# EAGLE design sampler (EAGLE 9.6.2)

## Sheet 1 of 2
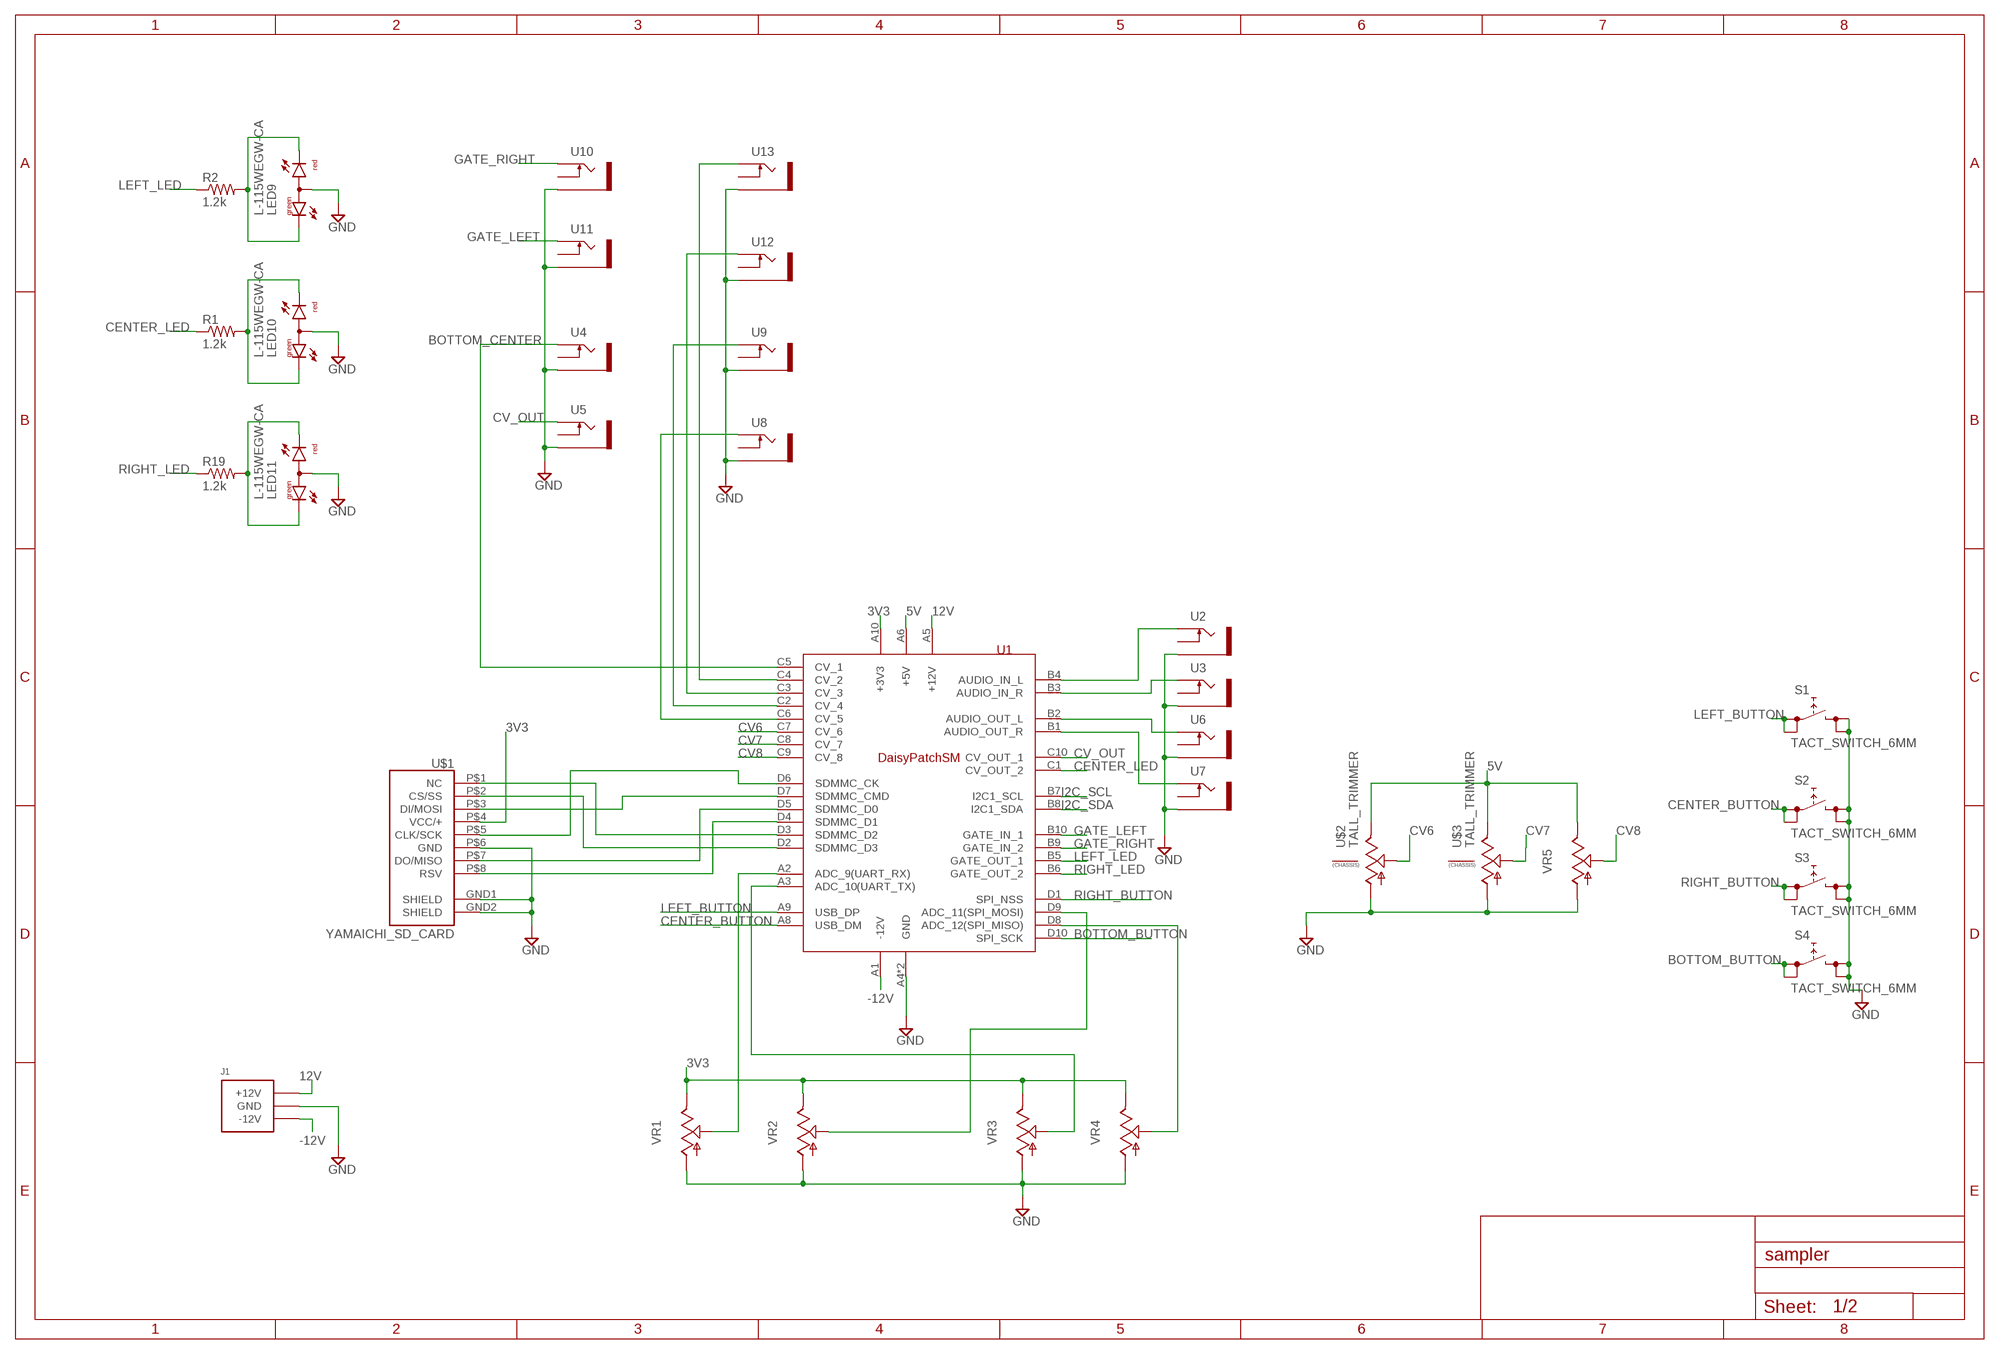
[diagram p0: schematic, sheet 1]

### Parts
J1  POWER_SIMPLE10  [POWER_10]
LED9  L-115WEGW-CA  [DUOLED-A-3MM]
LED10  L-115WEGW-CA  [DUOLED-A-3MM]
LED11  L-115WEGW-CA  [DUOLED-A-3MM]
R1  1.2k  R-US_R0603  [R0603]
R2  1.2k  R-US_R0603  [R0603]
R19  1.2k  R-US_R0603  [R0603]
S1  TACT_SWITCH_6MM  [TACT_SWITCH_6MM]
S2  TACT_SWITCH_6MM  [TACT_SWITCH_6MM]
S3  TACT_SWITCH_6MM  [TACT_SWITCH_6MM]
S4  TACT_SWITCH_6MM  [TACT_SWITCH_6MM]
U1  ES_DAISY_PATCH_SM  [ES_DAISY_PATCH_SM_REV1]
U2  THONKICONNNEW  [WQP-PJ301M-12_JACK]
U3  THONKICONNNEW  [WQP-PJ301M-12_JACK]
U4  THONKICONNNEW  [WQP-PJ301M-12_JACK]
U5  THONKICONNNEW  [WQP-PJ301M-12_JACK]
U6  THONKICONNNEW  [WQP-PJ301M-12_JACK]
U7  THONKICONNNEW  [WQP-PJ301M-12_JACK]
U8  THONKICONNNEW  [WQP-PJ301M-12_JACK]
U9  THONKICONNNEW  [WQP-PJ301M-12_JACK]
U10  THONKICONNNEW  [WQP-PJ301M-12_JACK]
U11  THONKICONNNEW  [WQP-PJ301M-12_JACK]
U12  THONKICONNNEW  [WQP-PJ301M-12_JACK]
U13  THONKICONNNEW  [WQP-PJ301M-12_JACK]
U$1  YAMAICHI_SD_CARD  [YAMAICHI_MICROSD_VERTICAL]
U$2  TALL_TRIMMER  [TALL_TRIMMER]
U$3  TALL_TRIMMER  [TALL_TRIMMER]
VR1  9MM_SNAP-IN_POT_  [9MM_SNAP-IN_POT]
VR2  9MM_SNAP-IN_POT_  [9MM_SNAP-IN_POT]
VR3  9MM_SNAP-IN_POT_  [9MM_SNAP-IN_POT]
VR4  9MM_SNAP-IN_POT_  [9MM_SNAP-IN_POT]
VR5  9MM_SNAP-IN_POT_  [9MM_SNAP-IN_POT]

### Nets
3V3: U1.A10(+3V3) U$1.P$4(VCC/+) VR1.3(E) VR2.3(E) VR3.3(E) VR4.3(E) ; also sheet 2
5V: U1.A6(+5V) U$2.3(E) U$3.3(E) VR5.3(E)
12V: J1.9(+12V) J1.10(+12V) U1.A5(+12V)
-12V: J1.1(-12V) J1.2(-12V) U1.A1(-12V)
BOTTOM_BUTTON: S4.P$1 S4.P$2 U1.D10(SPI_SCK)
BOTTOM_CENTER: U1.C5(CV_1) U4.P$1_TIP(TIP)
CENTER_BUTTON: S2.P$1 S2.P$2 U1.A8(USB_DM)
CENTER_LED: R1.1 U1.C1(CV_OUT_2)
CV6: U1.C7(CV_6) U$2.2(S)
CV7: U1.C8(CV_7) U$3.2(S)
CV8: U1.C9(CV_8) VR5.2(S)
CV_OUT: U1.C10(CV_OUT_1) U5.P$1_TIP(TIP)
GATE_LEFT: U1.B10(GATE_IN_1) U11.P$1_TIP(TIP)
GATE_RIGHT: U1.B9(GATE_IN_2) U10.P$1_TIP(TIP)
GND: J1.3(GND) J1.4(GND) J1.5(GND) J1.6(GND) J1.7(GND) J1.8(GND) LED9.2(A) LED10.2(A) LED11.2(A) S1.P$3 S1.P$4 S2.P$3 S2.P$4 S3.P$3 S3.P$4 S4.P$3 S4.P$4 U1.A4(GND) U1.A7(GND) U2.P$3_SLEEVE(SLEEVE) U3.P$3_SLEEVE(SLEEVE) U4.P$3_SLEEVE(SLEEVE) U5.P$3_SLEEVE(SLEEVE) U6.P$3_SLEEVE(SLEEVE) U7.P$3_SLEEVE(SLEEVE) U8.P$3_SLEEVE(SLEEVE) U9.P$3_SLEEVE(SLEEVE) U10.P$3_SLEEVE(SLEEVE) U11.P$3_SLEEVE(SLEEVE) U12.P$3_SLEEVE(SLEEVE) U13.P$3_SLEEVE(SLEEVE) U$1.GND1(SHIELD) U$1.GND2(SHIELD) U$1.P$6(GND) U$2.1(A) U$3.1(A) VR1.1(A) VR2.1(A) VR3.1(A) VR4.1(A) VR5.1(A) ; also sheet 2
I2C_SCL: U1.B7(I2C1_SCL) ; also sheet 2
I2C_SDA: U1.B8(I2C1_SDA) ; also sheet 2
LEFT_BUTTON: S1.P$1 S1.P$2 U1.A9(USB_DP)
LEFT_LED: R2.1 U1.B5(GATE_OUT_1)
N$1: U1.D3(SDMMC_D2) U$1.P$1(NC)
N$2: LED9.1(CG) LED9.3(CR) R2.2
N$4: U1.D4(SDMMC_D1) U$1.P$8(RSV)
N$5: U1.D5(SDMMC_D0) U$1.P$7(DO/MISO)
N$6: U1.D2(SDMMC_D3) U$1.P$2(CS/SS)
N$7: U1.D6(SDMMC_CK) U$1.P$5(CLK/SCK)
N$8: U1.D7(SDMMC_CMD) U$1.P$3(DI/MOSI)
N$9: U1.B2(AUDIO_OUT_L) U6.P$1_TIP(TIP)
N$10: U1.B4(AUDIO_IN_L) U2.P$1_TIP(TIP)
N$11: U1.B3(AUDIO_IN_R) U3.P$1_TIP(TIP)
N$12: U1.B1(AUDIO_OUT_R) U7.P$1_TIP(TIP)
N$13: U1.A3(ADC_10(UART_TX)) VR3.2(S)
N$14: U1.A2(ADC_9(UART_RX)) VR1.2(S)
N$15: U1.D9(ADC_11(SPI_MOSI)) VR2.2(S)
N$16: U1.D8(ADC_12(SPI_MISO)) VR4.2(S)
N$17: LED10.1(CG) LED10.3(CR) R1.2
N$18: U1.C4(CV_2) U13.P$1_TIP(TIP)
N$19: U1.C3(CV_3) U12.P$1_TIP(TIP)
N$20: LED11.1(CG) LED11.3(CR) R19.2
N$21: U1.C2(CV_4) U9.P$1_TIP(TIP)
N$22: U1.C6(CV_5) U8.P$1_TIP(TIP)
RIGHT_BUTTON: S3.P$1 S3.P$2 U1.D1(SPI_NSS)
RIGHT_LED: R19.1 U1.B6(GATE_OUT_2)
Unconnected: U2.P$2_SWITCH(SWITCH) U3.P$2_SWITCH(SWITCH) U4.P$2_SWITCH(SWITCH) U5.P$2_SWITCH(SWITCH) U6.P$2_SWITCH(SWITCH) U7.P$2_SWITCH(SWITCH) U8.P$2_SWITCH(SWITCH) U9.P$2_SWITCH(SWITCH) U10.P$2_SWITCH(SWITCH) U11.P$2_SWITCH(SWITCH) U12.P$2_SWITCH(SWITCH) U13.P$2_SWITCH(SWITCH) U$2.CHASSIS1 U$2.CHASSIS2 U$3.CHASSIS1 U$3.CHASSIS2

## Sheet 2 of 2
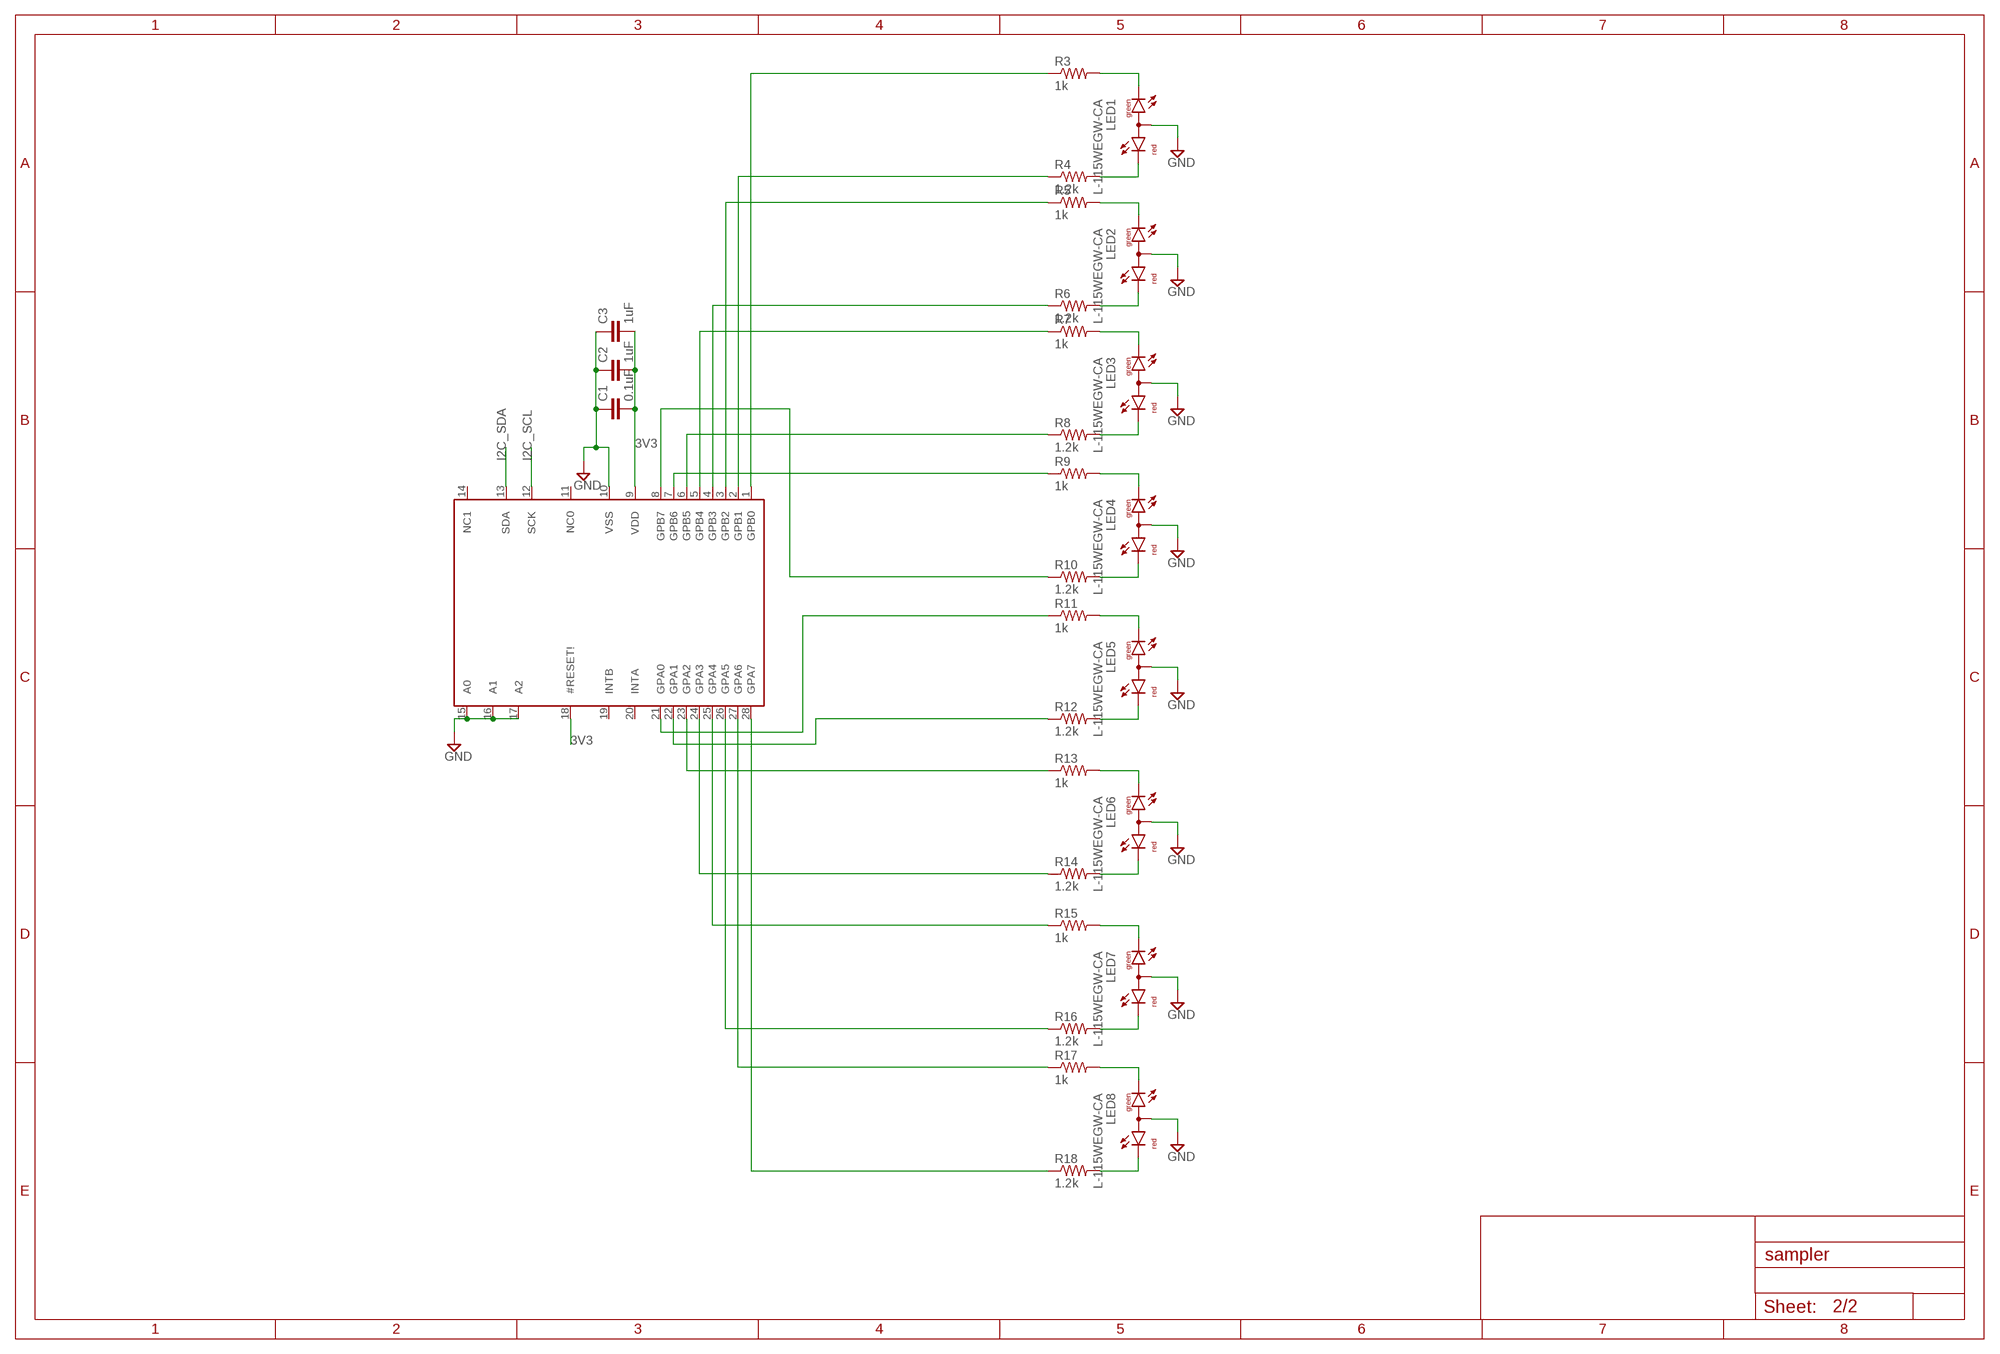
[diagram p1: schematic, sheet 2]

### Parts
C1  0.1uF  C-EUC0805  [C0805]
C2  1uF  C-EUC0805  [C0805]
C3  1uF  C-EUC0805  [C0805]
LED1  L-115WEGW-CA  [DUOLED-A-3MM]
LED2  L-115WEGW-CA  [DUOLED-A-3MM]
LED3  L-115WEGW-CA  [DUOLED-A-3MM]
LED4  L-115WEGW-CA  [DUOLED-A-3MM]
LED5  L-115WEGW-CA  [DUOLED-A-3MM]
LED6  L-115WEGW-CA  [DUOLED-A-3MM]
LED7  L-115WEGW-CA  [DUOLED-A-3MM]
LED8  L-115WEGW-CA  [DUOLED-A-3MM]
R3  1k  R-US_R0603  [R0603]
R4  1.2k  R-US_R0603  [R0603]
R5  1k  R-US_R0603  [R0603]
R6  1.2k  R-US_R0603  [R0603]
R7  1k  R-US_R0603  [R0603]
R8  1.2k  R-US_R0603  [R0603]
R9  1k  R-US_R0603  [R0603]
R10  1.2k  R-US_R0603  [R0603]
R11  1k  R-US_R0603  [R0603]
R12  1.2k  R-US_R0603  [R0603]
R13  1k  R-US_R0603  [R0603]
R14  1.2k  R-US_R0603  [R0603]
R15  1k  R-US_R0603  [R0603]
R16  1.2k  R-US_R0603  [R0603]
R17  1k  R-US_R0603  [R0603]
R18  1.2k  R-US_R0603  [R0603]
U$4  MCP23017  [SSOP28]

### Nets
3V3: C1.2 C2.2 C3.2 U$4.9(VDD) U$4.18(#RESET!) ; also sheet 1
GND: C1.1 C2.1 C3.1 LED1.2(A) LED2.2(A) LED3.2(A) LED4.2(A) LED5.2(A) LED6.2(A) LED7.2(A) LED8.2(A) U$4.10(VSS) U$4.15(A0) U$4.16(A1) U$4.17(A2) ; also sheet 1
I2C_SCL: U$4.12(SCK) ; also sheet 1
I2C_SDA: U$4.13(SDA) ; also sheet 1
N$3: R3.1 U$4.1(GPB0)
N$23: LED1.1(CG) R3.2
N$24: LED1.3(CR) R4.2
N$25: R4.1 U$4.2(GPB1)
N$26: R5.1 U$4.3(GPB2)
N$27: LED2.1(CG) R5.2
N$28: LED2.3(CR) R6.2
N$29: R6.1 U$4.4(GPB3)
N$30: R7.1 U$4.5(GPB4)
N$31: LED3.1(CG) R7.2
N$32: LED3.3(CR) R8.2
N$33: R8.1 U$4.6(GPB5)
N$34: R9.1 U$4.7(GPB6)
N$35: LED4.1(CG) R9.2
N$36: LED4.3(CR) R10.2
N$37: R10.1 U$4.8(GPB7)
N$38: R11.1 U$4.21(GPA0)
N$39: LED5.1(CG) R11.2
N$40: LED5.3(CR) R12.2
N$41: R12.1 U$4.22(GPA1)
N$42: R13.1 U$4.23(GPA2)
N$43: LED6.1(CG) R13.2
N$44: LED6.3(CR) R14.2
N$45: R14.1 U$4.24(GPA3)
N$46: R15.1 U$4.25(GPA4)
N$47: LED7.1(CG) R15.2
N$48: LED7.3(CR) R16.2
N$49: R16.1 U$4.26(GPA5)
N$50: R17.1 U$4.27(GPA6)
N$51: LED8.1(CG) R17.2
N$52: LED8.3(CR) R18.2
N$53: R18.1 U$4.28(GPA7)
Unconnected: U$4.11(NC0) U$4.14(NC1) U$4.19(INTB) U$4.20(INTA)

## Library data of the parts
C1-C3 = rcl:C-EU: CAPACITOR, European symbol; SPICEPREFIX: C
J1 = BitFox:POWER_SIMPLE
LED1-LED11 = led:L-115WEGW-CA: T-1(3mm) BI-COLOR INDICATOR LAMP Source: Kingbright .. 2_colour_led_.pdf
R1-R19 = rcl:R-US_: RESISTOR, American symbol; SPICEPREFIX: R
S1-S4 = BitFox:TACT_SWITCH_6MM
U1 = Electrosmith_Boards:ES_DAISY_PATCH_SM
U2-U13 = MusicThingModular:THONKICONN: 3.5mm socket for Eurorack modular synths
U$1 = MusicThingModular:YAMAICHI_SD_CARD: Vertical SD Card Holder
U$2 U$3 = BitFox:TALL_TRIMMER
U$4 = BitFox:MCP23017
VR1-VR5 = BitFox:9MM_SNAP-IN_POT: 9mm vertical snap-in pot, Alpha / Panasonic style

## Board
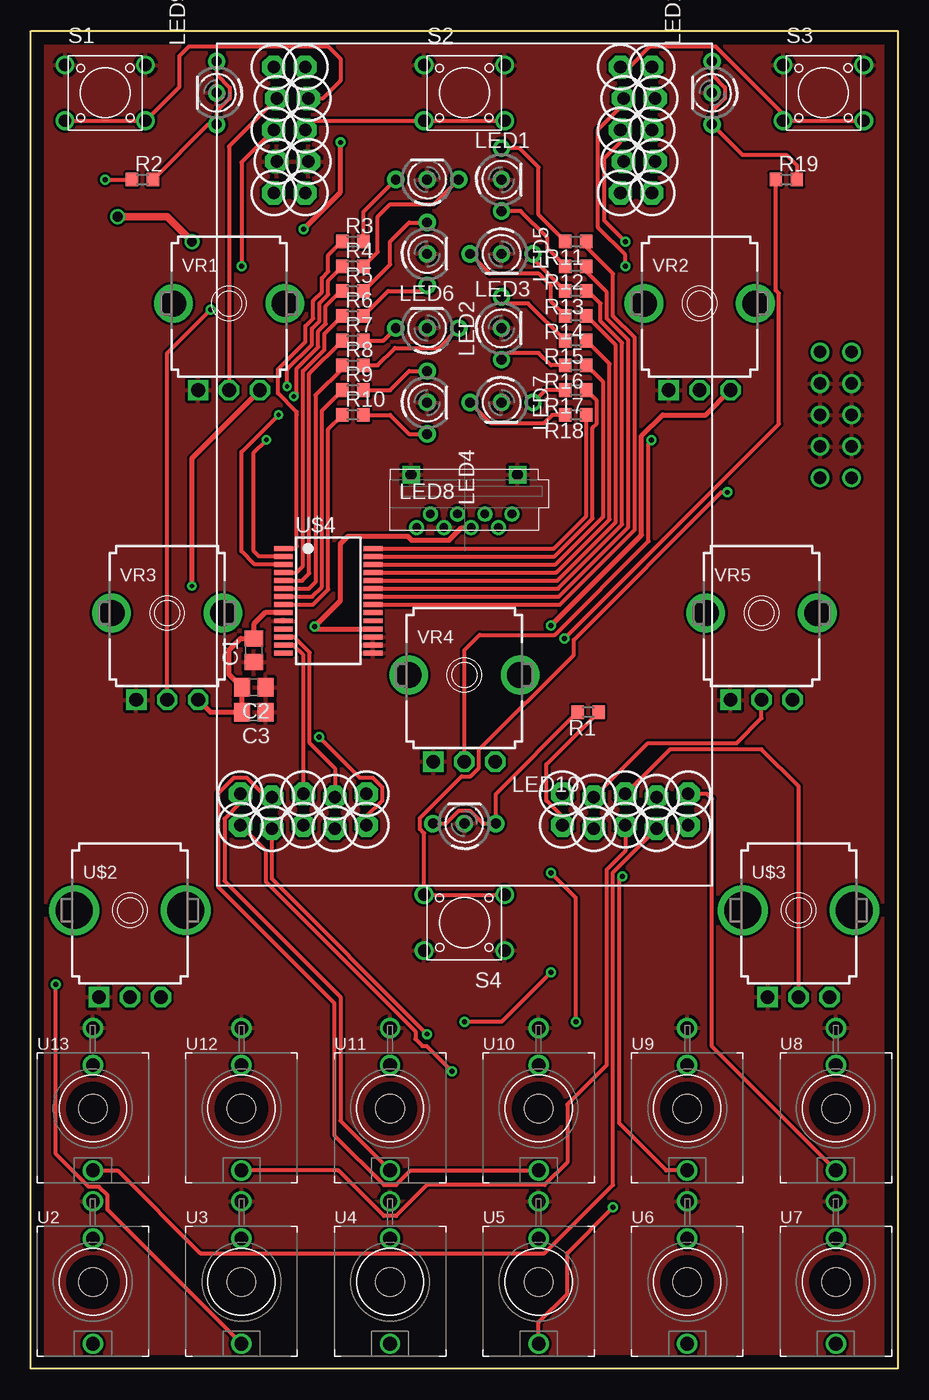
[diagram p2: board, top side]
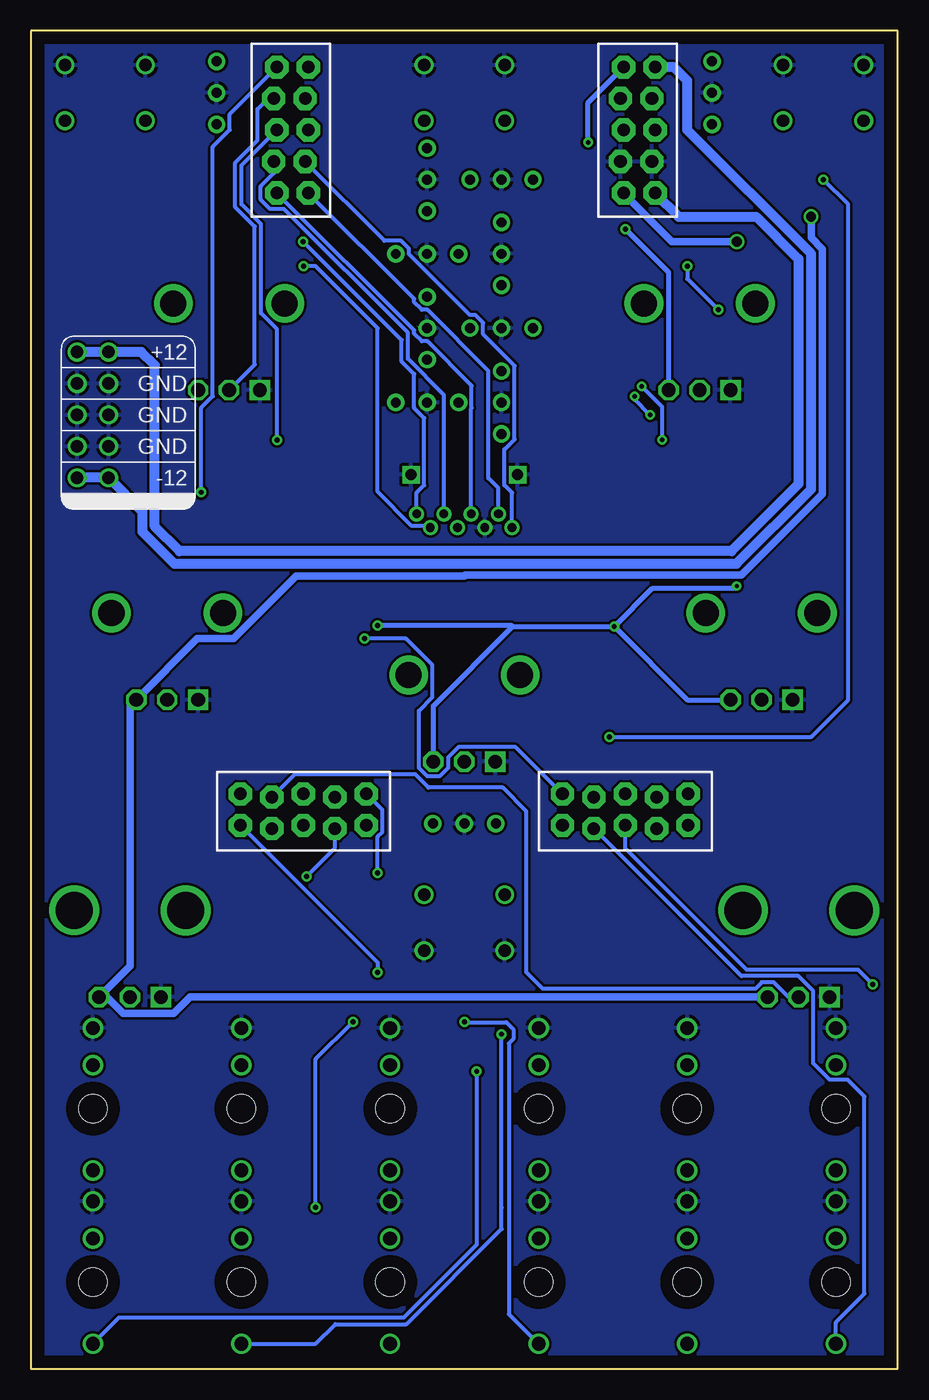
[diagram p3: board, bottom side, seen from below]

Size 70 x 108 mm. Coordinates in mm from the lower left corner, seen from the top.
Outline: 0,0 0,108 70,108 70,0 0,0
Copper layers (1*16): Top 0.035mm / dielectric 1.5mm / Bottom 0.035mm
Design rules "default *": minimum track width 8mil, minimum drill 0.35mm, track to track 8mil, track to pad 8mil, pad to pad 8mil, via to via 8mil, smd to smd 8mil, copper to edge 40mil, drill to drill 6mil, minimum pad ring 10mil, minimum via ring 8mil, stop-mask expansion 4mil, vias tented up to drill 0mil, thermal gap 10mil

### Footprints (pad centres in the part's own frame; a part is rotated, then mirrored left to right if it is on the bottom)
C0805 = smd 1.3 x 1.5: 1 -0.95,0; 2 0.95,0
POWER_10 = drill 1.016: 1 -5.08,-1.27; 2 -5.08,1.27; 3 -2.54,-1.27; 4 -2.54,1.27; 5 0,-1.27; 6 0,1.27; 7 2.54,-1.27; 8 2.54,1.27; 9 5.08,-1.27; 10 5.08,1.27
DUOLED-A-3MM = drill 0.8 pad 1.4: 1 -2.54,0; 2 0,0; 3 2.54,0
R0603 = smd 1 x 1.1: 1 -0.85,0; 2 0.85,0
TACT_SWITCH_6MM = drill 1: P$1 -3.25,-2.25; P$2 3.25,-2.25; P$3 -3.25,2.25; P$4 3.25,2.25
ES_DAISY_PATCH_SM_REV1 = drill 1.016 pad 1.88 octagon: A1 -32.08,-15.397; A2 -29.54,-15.143; A3 -27,-15.397; A4 -24.46,-15.143; A5 -21.92,-15.397; A6 -21.92,-12.857; A7 -24.46,-12.603; A8 -27,-12.857; A9 -29.54,-12.603; A10 -32.08,-12.857; B1 29.143,-18.08; B2 29.397,-15.54; B3 29.143,-13; B4 29.397,-10.46; B5 29.143,-7.92; B6 26.603,-7.92; B7 26.857,-10.46; B8 26.603,-13; B9 26.857,-15.54; B10 26.603,-18.08; C1 29.143,7.92; C2 29.397,10.46; C3 29.143,13; C4 29.397,15.54; C5 29.143,18.08; C6 26.603,18.08; C7 26.857,15.54; C8 26.603,13; C9 26.857,10.46; C10 26.603,7.92; D1 -32.08,12.603; D2 -29.54,12.857; D3 -27,12.603; D4 -24.46,12.857; D5 -21.92,12.603; D6 -21.92,15.143; D7 -24.46,15.397; D8 -27,15.143; D9 -29.54,15.397; D10 -32.08,15.143
WQP-PJ301M-12_JACK = drill 1.1: P$1_TIP 0,5; P$2_SWITCH 0,-3.5; P$3_SLEEVE 0,-6.5 | hole 2.286: 0,0
YAMAICHI_MICROSD_VERTICAL = drill 0.9 square: GND1 -4.3,-3.17; GND2 4.3,-3.17 | drill 0.7: P$1 -3.85,0; P$2 -2.75,1.1; P$3 -1.65,0; P$4 -0.55,1.1; P$5 0.55,0; P$6 1.65,1.1; P$7 2.75,0; P$8 3.85,1.1
TALL_TRIMMER = drill 1.1 square: 1 -2.5,-7 | drill 1.1 octagon: 2 0,-7; 3 2.5,-7 | drill 3.003 pad 3.48: CHASSIS1 -4.5,0 | drill 2.997 pad 3.48: CHASSIS2 4.5,0
SSOP28 = smd 0.4 x 1.5: 1 -4.225,-3.625; 2 -3.575,-3.625; 3 -2.925,-3.625; 4 -2.275,-3.625; 5 -1.625,-3.625; 6 -0.975,-3.625; 7 -0.325,-3.625; 8 0.325,-3.625; 9 0.975,-3.625; 10 1.625,-3.625; 11 2.275,-3.625; 12 2.925,-3.625; 13 3.575,-3.625; 14 4.225,-3.625; 15 4.225,3.625; 16 3.575,3.625; 17 2.925,3.625; 18 2.275,3.625; 19 1.625,3.625; 20 0.975,3.625; 21 0.325,3.625; 22 -0.325,3.625; 23 -0.975,3.625; 24 -1.625,3.625; 25 -2.275,3.625; 26 -2.925,3.625; 27 -3.575,3.625; 28 -4.225,3.625
9MM_SNAP-IN_POT = drill 1.1 square: 1 -2.5,-7 | drill 1.1 octagon: 2 0,-7; 3 2.5,-7 | drill 2.1 pad 2.794: CHASSIS1 -4.5,0; CHASSIS2 4.5,0

### Placement (x,y rotation side)
C1  18,58 90 top
C2  18,55 180 top
C3  18,53 180 top
J1  65,77 90 bottom
LED1  32,96 0 top
LED2  32,90 270 top
LED3  32,84 0 top
LED4  32,78 270 top
LED5  38,96 270 top
LED6  38,90 180 top
LED7  38,84 270 top
LED8  38,78 180 top
LED9  15,103 90 top
LED10  35,44 0 top
LED11  55,103 90 top
R1  45,53 180 top
R2  9,96 0 top
R3  26,91 0 top
R4  26,89 0 top
R5  26,87 0 top
R6  26,85 0 top
R7  26,83 0 top
R8  26,81 0 top
R9  26,79 0 top
R10  26,77 0 top
R11  44,91 180 top
R12  44,89 180 top
R13  44,87 180 top
R14  44,85 180 top
R15  44,83 180 top
R16  44,81 180 top
R17  44,79 180 top
R18  44,77 180 top
R19  61,96 0 top
S1  6,103 0 top
S2  35,103 0 top
S3  64,103 0 top
S4  35,36 180 top
U1  35,73 270 top
U2  5,7 180 top
U3  17,7 180 top
U4  29,7 180 top
U5  41,7 180 top
U6  53,7 180 top
U7  65,7 180 top
U8  65,21 180 top
U9  53,21 180 top
U10  41,21 180 top
U11  29,21 180 top
U12  17,21 180 top
U13  5,21 180 top
U$1  35,69 180 top
U$2  8,37 0 top
U$3  62,37 0 top
U$4  24,62 270 top
VR1  16,86 0 top
VR2  54,86 0 top
VR3  11,61 0 top
VR4  35,56 0 top
VR5  59,61 0 top

### Tracks (layer width: path | path; a pad name or v marks a point on that pad's centre or on a via)
3V3  (via drill 0.35, 0.4)
  Top 0.406: U$4.18 23.07,59.73 v22.9,59.9 25,62 25,66.6 25.6,67.2 30.42,67.2 30.73,66.89 33.77,66.89 34.78,67.9 U$1.P$4 | v42,60 49.31,67.31 49.31,75.31 51,77 54.5,77 VR2.3 | v22,92 25,95 v25,99 | v13,63.18 13,73.5 VR1.3 | U$4.9 18.93,61.02 18,60.1 C1.2 16.95,58.95 16,58 16,56.05 C2.2 C3.2 14.5,53 VR3.3
  Bottom 0.406: v22.9,59.9 17,54 VR3.3 | VR4.3 37.5,53.5 31.1,59.9 | 31.1,59.9 v22.9,59.9 | 31.1,59.9 31.2,60 v42,60 | VR1.3 18.5,88.5 v22,92 | v25,99 25,102.22 U1.A10 | v22.9,59.9 19.8,63 13.18,63 v13,63.18
5V  (via drill 0.8)
  Top 0.61: v7,93 11,93 v13,91
  Bottom 0.61: U$2.3 57.13,30 58.47,28.67 62.55,28.67 63.88,30 U$3.3 62,32.5 62,53.5 VR5.3 56.57,58.93 53.64,58.93 48.58,64 35,64 34.93,64.07 12.64,64.07 6.09,70.62 6.09,90.38 7,91.29 v7,93 | v13,91 18.22,91 U1.A6
12V
  Bottom 0.813: J1.10 J1.9 61.08,82.08 60,81 60,68 58,66 13.44,66 8.02,71.42 8.02,89.58 11.44,93 17.68,93 U1.A5
-12V
  Bottom 0.813: J1.2 J1.1 61.02,69.21 61.02,67.58 58.42,64.98 13.02,64.98 7,71 7,90 17,100 17,104 18.08,105.08 U1.A1
BOTTOM_BUTTON  (via drill 0.4)
  Top 0.305: S4.P$1 S4.P$2 31.75,43.22 31.4,43.56 31.4,44.44 34.79,47.82 35.49,47.82 36.18,48.51 36.18,49.97 43.83,57.63 43.83,58.83 55.75,70.75 v56.25,70.75
  Bottom 0.305: v56.25,70.75 56.25,77.58 55.32,78.51 55.32,98.65 53.94,100.02 53.94,101.28 U1.D10
BOTTOM_CENTER  (via drill 0.4)
  Top 0.305: v42,32 38,28 v35,28
  Bottom 0.305: U1.C5 42,32.78 v42,32 | v35,28 34.96,27.96 31.6,27.96 31.04,27.4 31.04,26.6 31.4,26.24 31.4,4.4 U4.P$1_TIP
CENTER_BUTTON
  Top 0.305: U1.A8 22.89,100.75 S2.P$1 S2.P$2
CENTER_LED
  Top 0.305: U1.C1 42.92,44.56 41.62,45.86 41.62,48.77 R1.1
CV6
  Bottom 0.305: U1.C7 48.68,48 39,48 37.9,46.9 31.9,46.9 30,45 30,32 28.66,30.66 11.51,30.66 10.99,31.18 10.01,31.18 8.83,30 U$2.2
CV7
  Top 0.305: U1.C8 51.6,50 59,50 62,47 U$3.2
CV8
  Top 0.305: U1.C9 49.83,50.51 57,50.51 59,52.51 VR5.2
CV_OUT  (via drill 0.4)
  Top 0.305: U5.P$1_TIP 41,3.73 43.31,6.04 43.31,9.31 v47,13 | v44,28 44,38 v42,40
  Bottom 0.305: v47,13 47,25 v44,28 | v42,40 42,42.95 41.62,43.32 41.62,45.1 U1.C10
GATE_LEFT
  Top 0.305: U1.B10 16.92,45.69 15.62,44.39 15.62,39.38 25,30 25,20 U11.P$1_TIP
GATE_RIGHT
  Top 0.305: U1.B9 19.01,46.14 17.46,47.69 16.38,47.69 15.12,46.43 15.12,38.88 24.49,29.51 24.49,18.84 28.51,14.82 29.49,14.82 30.67,16 U10.P$1_TIP
GND
  pour Top: 0,108 0,0 70,0 70,108
  pour Bottom: 0,108 70,108 70,0 0,0
I2C_SCL
  Top 0.305: 21.02,59.08 U$4.12 21.25,59.08 22.51,57.81 22.51,50.49 24.54,48.46 U1.B7
I2C_SDA
  Top 0.305: U1.B8 22,57.6 21.18,58.42 U$4.13
LEFT_BUTTON
  Top 0.305: S1.P$1 S1.P$2 12,103.5 12,106 12.76,106.75 24,106.75 25,105.75 25,104 23.54,102.54 U1.A9
LEFT_LED  (via drill 0.4)
  Top 0.305: v23.27,51 26.57,47.69 27.62,47.69 28.38,46.93 28.38,45.86 27.08,44.56 U1.B5 | v6,96 R2.1
  Bottom 0.305: v23.27,51 7,51 4,54 4,94 v6,96
N$1  (via drill 0.4)
  Top 0.305: U1.D3 47.6,99.04 46.31,97.74 46.31,92.69 v48.01,90.99
  Bottom 0.305: v48.01,90.99 40.07,83.06 40.07,81.32 39.06,80.3 39.06,77.56 38.24,76.75 38.24,71.32 38.85,70.71 U$1.P$1
N$2
  Top 0.305: LED9.3 15,104.49 16.06,103.44 16.06,102.56 15,101.51 LED9.1 14.31,100.46 R2.2
N$3
  Top 0.305: R3.1 25.1,91 24,89.9 24,88.57 23.49,88.06 23.49,86.93 22.78,86.22 22.78,84.79 22.18,84.18 22.18,82.9 19.95,80.68 19.95,78.75 21.46,77.24 21.46,77 21.46,66.4 21.29,66.22 U$4.1
N$4
  Bottom 0.305: U$1.P$8 31.15,70.71 31.76,71.32 31.76,74.21 30.94,75.02 30.94,80.98 33.48,83.52 33.48,84.44 34.1,85.06 34.55,85.06 39.48,89.99 39.48,90.44 40.1,91.06 41.45,91.06 U1.D4
N$5
  Bottom 0.305: U$1.P$7 32.25,71.09 33.06,71.9 33.06,80.55 37.99,85.48 38.44,85.48 39.06,86.1 39.06,86.37 U1.D5
N$6  (via drill 0.4)
  Top 0.305: v48,89 48,89.93 45.8,92.13 45.8,100.03 47.86,102.09 U1.D2
  Bottom 0.305: U$1.P$2 37.89,68.04 39.25,68.04 42,70.79 42,84 47,89 v48,89
N$7
  Bottom 0.305: U$1.P$5 34.45,77.52 34.4,77.56 34.4,79.36 37.99,82.94 38.44,82.94 39.06,83.56 39.06,83.83 U1.D6
N$8
  Bottom 0.305: U$1.P$3 36.65,78.62 39.56,81.53 39.56,83.62 49.57,93.62 50.68,93.62 51.44,94.38 51.44,95.46 50.4,96.5 U1.D7
N$9  (via drill 0.4)
  Top 0.305: v32,27 19.46,39.54 U1.B2
  Bottom 0.305: v32,27 32,13 32,11.28 39.69,3.59 45.41,3.59 47,2 U6.P$1_TIP
N$10
  Bottom 0.305: U2.P$1_TIP 5,3.73 2.69,6.04 2.69,21.96 4.05,23.32 5.49,23.32 6.82,24.65 6.82,30.49 8.02,31.69 12.63,31.69 U1.B4
N$11  (via drill 0.4)
  Top 0.305: U3.P$1_TIP 6.18,12.82 6.18,13.99 5.49,14.68 4.65,14.68 2,17.33 v2,31
  Bottom 0.305: v2,31 3.2,32.2 12.2,32.2 22,42 U1.B3
N$12  (via drill 0.4)
  Top 0.305: U1.B1 18.95,41.83 18.95,39.33 31.04,27.24 31.04,26.6 31.6,26.04 31.96,26.04 v34,24
  Bottom 0.305: U7.P$1_TIP 62.9,4.1 39.9,4.1 34,10 v34,24
N$13  (via drill 0.4)
  Top 0.305: VR3.2 11,82 v14.5,85.5 | U1.A3 17,97.4 v17,89
  Bottom 0.305: v17,89 17,88 v14.5,85.5
N$14
  Top 0.305: U1.A2 16,98.68 VR1.2
N$15
  Bottom 0.305: VR2.2 51.92,81.08 51.92,92.2 53.51,93.79 53.51,97.35 51.7,99.16 51.7,101.7 50.86,102.54 U1.D9
N$16  (via drill 0.4)
  Top 0.305: VR4.2 35,58 36.24,59.24 42.31,59.24 49.87,66.8 49.87,74.73 v50.12,74.98
  Bottom 0.305: v50.12,74.98 50.12,83.92 51.41,85.21 51.41,92.41 53,94 53,97.14 U1.D8
N$17
  Top 0.305: 37.54,44.69 LED10.3 | LED10.1 33.51,44 34.56,45.06 35.44,45.06 36.49,44 LED10.3 | LED10.3 37.54,46.39 R1.2
N$18
  Top 0.305: U1.C4 47,40.06 47,14.83 41.49,9.32 13.68,9.32 7,16 U13.P$1_TIP
N$19
  Top 0.305: U1.C3 48,41.78 46.49,40.27 46.49,24.49 43.31,21.31 43.31,16.64 41.49,14.82 31.99,14.82 29.49,12.32 28.51,12.32 24.83,16 U12.P$1_TIP
N$20
  Top 0.305: LED11.3 55,104.49 56.06,103.44 56.06,102.56 55,101.51 LED11.1 57.46,98 61,98 61.85,97.15 R19.2
N$21  (via drill 0.4)
  Top 0.305: U9.P$1_TIP 51.31,16 47.51,19.8 47.51,39.5 v47.76,39.75
  Bottom 0.305: v47.76,39.75 45.46,42.05 U1.C2
N$22
  Top 0.305: U8.P$1_TIP 55,26 55,46 54.6,46.4 U1.C6
N$23
  Top 0.305: R3.2 26.85,93.39 LED1.1
N$24
  Top 0.305: R4.2 28,90.15 28,93 29,94 32.54,94 LED1.3
N$25  (via drill 0.35)
  Top 0.305: 20.73,65.58 U$4.2 18.43,65.58 18,66 18,73.96 v19.02,74.98 | R4.1 24,87.85 24,86.72 23.29,86.01 23.29,84.58 22.68,83.97 22.68,82.69 20.69,80.69 v20.69,79.31
  Bottom 0.305: v19.02,74.98 19.02,77.64 v20.69,79.31
N$26  (via drill 0.35)
  Top 0.305: R5.1 25,87 23.8,85.8 23.8,84.37 23.19,83.76 23.19,82.48 21.46,80.75 21.46,78.73 v21.23,78.5 | U$4.3 18.07,64.92 17,66 17,74 v20,77
  Bottom 0.305: v20,77 21.23,78.23 v21.23,78.5
N$27
  Top 0.305: R5.2 29,89.15 29,91 30.54,92.54 LED2.1
N$28
  Top 0.305: R6.2 28.85,87 31.54,87 LED2.3
N$29
  Top 0.305: U$4.4 21.44,64.28 21.97,64.8 21.97,80.54 23.7,82.27 23.7,83.55 R6.1
N$30
  Top 0.305: U$4.5 21.9,63.62 22.48,64.2 22.48,80.33 R7.1
N$31
  Top 0.305: R7.2 28.46,83 LED3.1
N$32
  Top 0.305: R8.2 28,81 29.4,82.4 32.94,82.4 LED3.3
N$33
  Top 0.305: U$4.6 22.46,62.98 22.98,63.5 22.98,78.58 25.15,80.75 R8.1
N$34
  Top 0.305: U$4.7 22.71,62.33 23.49,63.11 23.49,77.34 R9.1
N$35
  Top 0.305: R9.2 29,79 30.54,80.54 LED4.1
N$36
  Top 0.305: R10.2 29,77 30.54,75.46 LED4.3
N$37
  Top 0.305: U$4.8 22.77,61.67 24,62.9 24,75.85 R10.1
N$38
  Top 0.305: U$4.21 42.7,61.67 48.75,67.72 48.75,83.25 47.02,84.99 47.02,88.39 44.85,90.55 R11.1
N$39
  Top 0.305: R11.2 41,93.15 41,97 39.46,98.54 LED5.1
N$40
  Top 0.305: R12.2 41.7,90.45 41.7,91.3 39.54,93.46 LED5.3
N$41
  Top 0.305: U$4.22 42.64,62.33 48.25,67.94 48.25,83.04 46.51,84.78 46.51,86.89 44.85,88.55 R12.1
N$42
  Top 0.305: U$4.23 42.57,62.98 47.74,68.14 47.74,82.83 46,84.57 46,86 45,87 R13.1
N$43
  Top 0.305: R13.2 40.54,89.61 LED6.1
N$44
  Top 0.305: R14.2 42,86.15 42,87.43 41.03,88.4 37.06,88.4 LED6.3
N$45
  Top 0.305: U$4.24 42.5,63.62 47.23,68.36 47.23,82.62 R14.1
N$46
  Top 0.305: U$4.25 42.43,64.28 46.72,68.57 46.72,81.13 R15.1
N$47
  Top 0.305: R15.2 40.15,86 38.54,86 LED7.1
N$48
  Top 0.305: R16.2 42,81 41,82 38.54,82 LED7.3
N$49
  Top 0.305: U$4.26 42.36,64.92 46.21,68.78 46.21,79.64 R16.1
N$50
  Top 0.305: U$4.27 42.29,65.58 45.36,68.64 45.36,75.95 45.71,76.3 45.71,78.14 R17.1
N$51
  Top 0.305: R17.2 41.54,79 LED8.1
N$52
  Top 0.305: R18.2 42.1,77 41.4,76.3 37.16,76.3 LED8.3
N$53
  Top 0.305: U$4.28 42.23,66.22 44.85,68.85 R18.1
RIGHT_BUTTON
  Top 0.305: S3.P$1 61,100.75 | 61,100.75 S3.P$2 | U1.D1 48.31,105.08 49.99,106.75 55.28,106.75 61,101.03 61,100.75
RIGHT_LED  (via drill 0.4)
  Top 0.305: R19.1 60.15,87.06 60.41,86.79 60.41,76.27 v43.07,58.93
  Bottom 0.305: U1.B6 30.86,50.18 35.49,50.18 36.32,49.35 36.32,48.51 37.01,47.82 37.99,47.82 38.68,48.51 38.68,53.11 37.59,54.2 37.59,56.79 39.72,58.93 v43.07,58.93